# Altium schematic sheet BMS.SchDoc
size A4; SheetNumber: 5; SheetTotal: 7
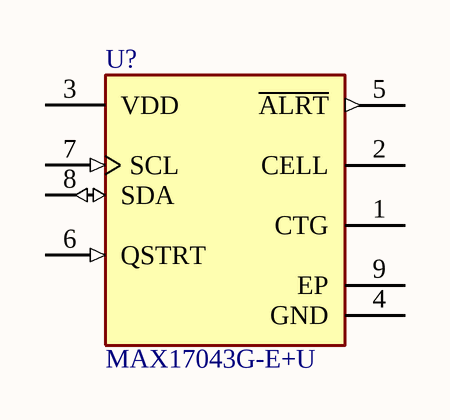
[diagram p0: BMS.SchDoc]

## Parts
U?  MAX17043G-E+U  [FP-T823-1-MFG]

## Nets

Not connected (* = marked no-connect by the designer): U? 1(CTG) 2(CELL) 3(VDD) 4(GND) 5(~{ALRT}) 6(QSTRT) 7(SCL) 8(SDA) 9(EP)

## Library data of the parts
U? = CMP-05715-000095-1: 1-Cell Fuel Gauge with ModelGauge and Low-Battery Alert; Manufacturer: Maxim; Max Supply Voltage: 4.5V; Standoff Height: 0mm; Min Supply Voltage: 2.5V; Number Of Cells: 1; Nominal Supply Current: 50uA; Device Class L2: Power Management ICs; Manufacturer Part Number: MAX17043G-E+U; Device Class L1: Integrated Circuits (ICs); Footprint Url: https://pdfserv.maximintegrated.com/land_patterns/90-0091.PDF; RoHS: TRUE; Category: IC; Temperature: -20°C to +70°C; Temperature Range High: +70°C; Package: T823-1; Device Class L3: Battery Management; Height: 0.8mm; Temperature Range Low: -20°C; ComponentLink2Description: Datasheet; Automotive: No; Lead Free: Yes; ComponentLink2URL: https://datasheets.maximintegrated.com/en/ds/MAX17043-MAX17044.pdf; Octopart: https://octopart.com/max17043g-e%2Bu-maxim+integrated-38558398